# Altium schematic sheet NONCONTACT-THERMOMETER.SchDoc
size A4
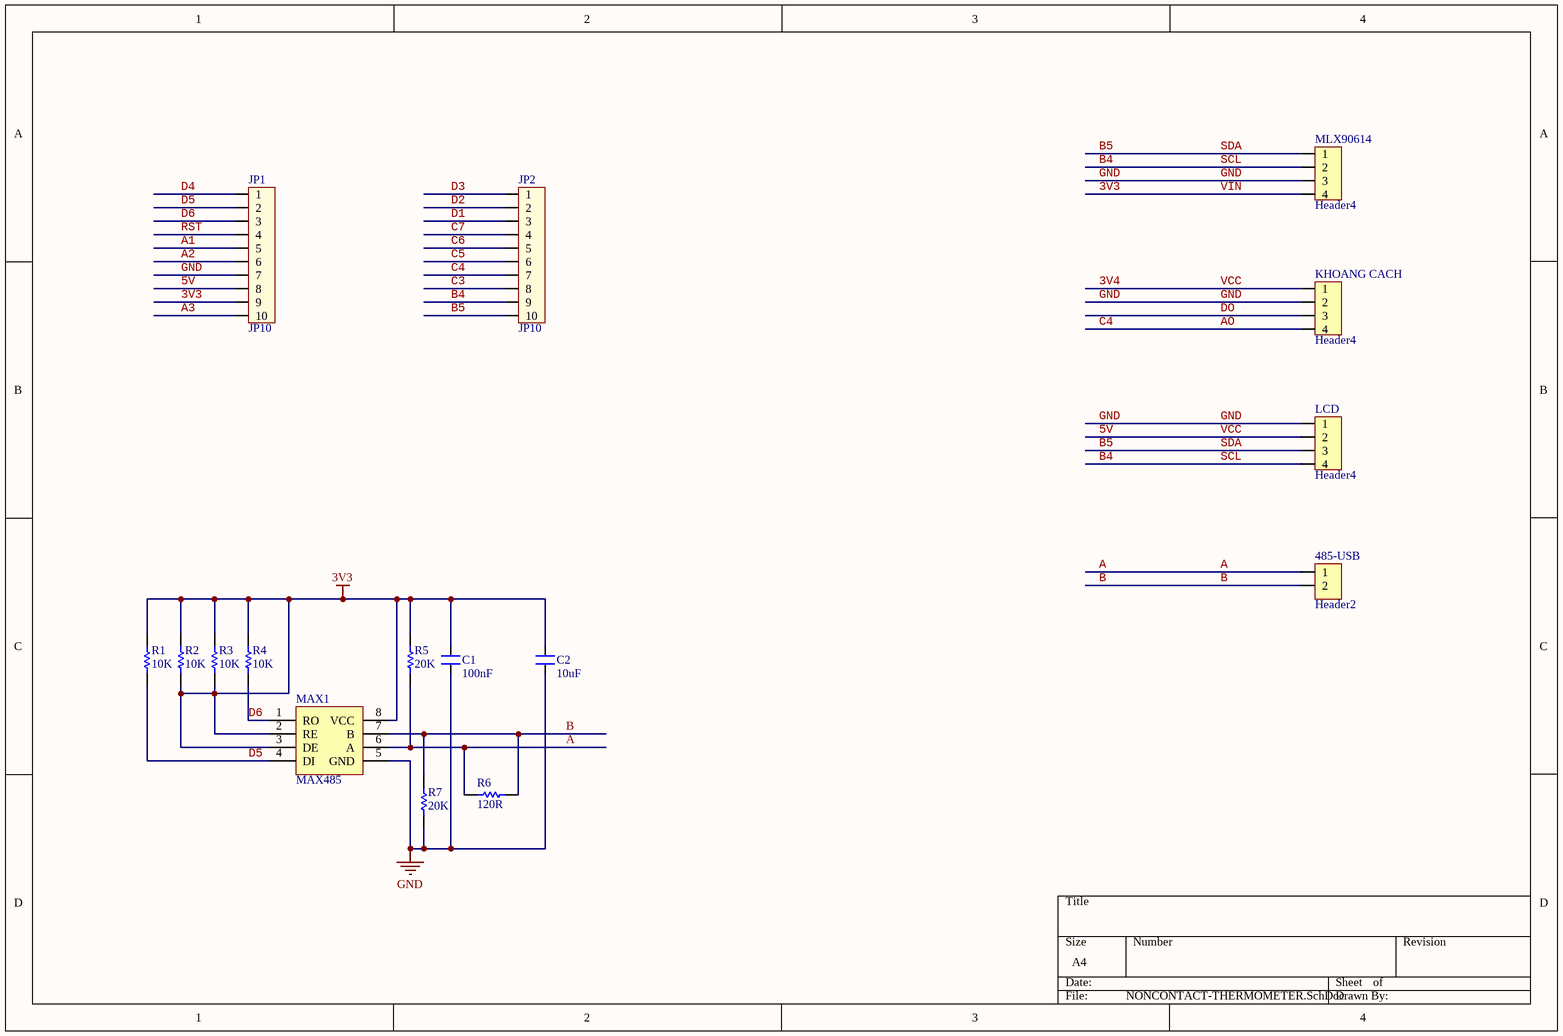
[diagram p0: NONCONTACT-THERMOMETER.SchDoc]

## Parts
485-USB  Header2  [HDR2]
C1  100nF  [CAP 0603(1508)]
C2  10uF  [CAP 0603(1508)]
JP1  JP10  [Header10]
JP2  JP10  [Header10]
KHOANG_CACH  Header4  [HDR4]
LCD  Header4  [HDR4]
MAX1  MAX485  [MAX485]
MLX90614  Header4  [HDR4]
R1  10K  [RES 0603(1608)]
R2  10K  [RES 0603(1608)]
R3  10K  [RES 0603(1608)]
R4  10K  [RES 0603(1608)]
R5  20K  [RES 0603(1608)]
R6  120R  [RES 0603(1608)]
R7  20K  [RES 0603(1608)]

## Nets
3V3: C1.1 C2.1 JP1.9 MAX1.2(RE) MAX1.3(DE) MAX1.8(VCC) MLX90614.4 R1.1 R2.1 R2.2 R3.1 R3.2 R4.1 R5.1  [also labelled VIN]
GND: C1.2 C2.2 JP1.7 KHOANG_CACH.2 LCD.1 MAX1.5(GND) MLX90614.3 R7.2
3V4: JP1.8 KHOANG_CACH.1 LCD.2  [also labelled 5V, VCC]
A: 485-USB.1 MAX1.6(A) R5.2 R6.1
A1: JP1.5
A2: JP1.6
A3: JP1.10
AO: JP2.7 KHOANG_CACH.4  [also labelled C4]
B: 485-USB.2 MAX1.7(B) R6.2 R7.1
B4: JP2.9 LCD.4 MLX90614.2  [also labelled SCL]
B5: JP2.10 LCD.3 MLX90614.1  [also labelled SDA]
C3: JP2.8
C5: JP2.6
C6: JP2.5
C7: JP2.4
D1: JP2.3
D2: JP2.2
D3: JP2.1
D4: JP1.1
D5: JP1.2 MAX1.4(DI) R1.2
D6: JP1.3 MAX1.1(RO) R4.2
DO: KHOANG_CACH.3
RST: JP1.4

## Library data of the parts
485-USB = Header2: Header IDC, 2 x 1 Pin Vertical 2.54mm Pitch (Non-Boxed, Male); Manufacturer: W¨¹rth Elektronik eiSos GmbH; partNo: 613002143121; ComponentLink1 Description: Manufacturer; ComponentLink2 Description: Datasheet; NoPins: 02; Created Date: 29 March 2013; ComponentLink1URL: http://www.we-online.com; ComponentLink2URL: http://katalog.we-online.de/em/datasheet/6130xx143121.pdf; Created by: Karrer Zheng
C1 C2 = CAP_CER_0.1uF_50V_NPOL_1: Ceramic Capacitor 1nF/50V (+-20% TH)/(+10%SMD)
JP1 JP2 = Header10: Connector 10; Value: Connector 10
KHOANG_CACH LCD MLX90614 = Header4: Header IDC, 4 x 1 Pin Vertical 2.54mm Pitch (Non-Boxed, Male); Manufacturer: W¨¹rth Elektronik eiSos GmbH; partNo: 613002143121; ComponentLink1 Description: Manufacturer; ComponentLink2 Description: Datasheet; NoPins: 02; Created Date: 29 March 2013; ComponentLink1URL: http://www.we-online.com; ComponentLink2URL: http://katalog.we-online.de/em/datasheet/6130xx143121.pdf; Created by: Karrer Zheng
MAX1 = MAX485: MAX3485
R1-R7 = Resistor 0603